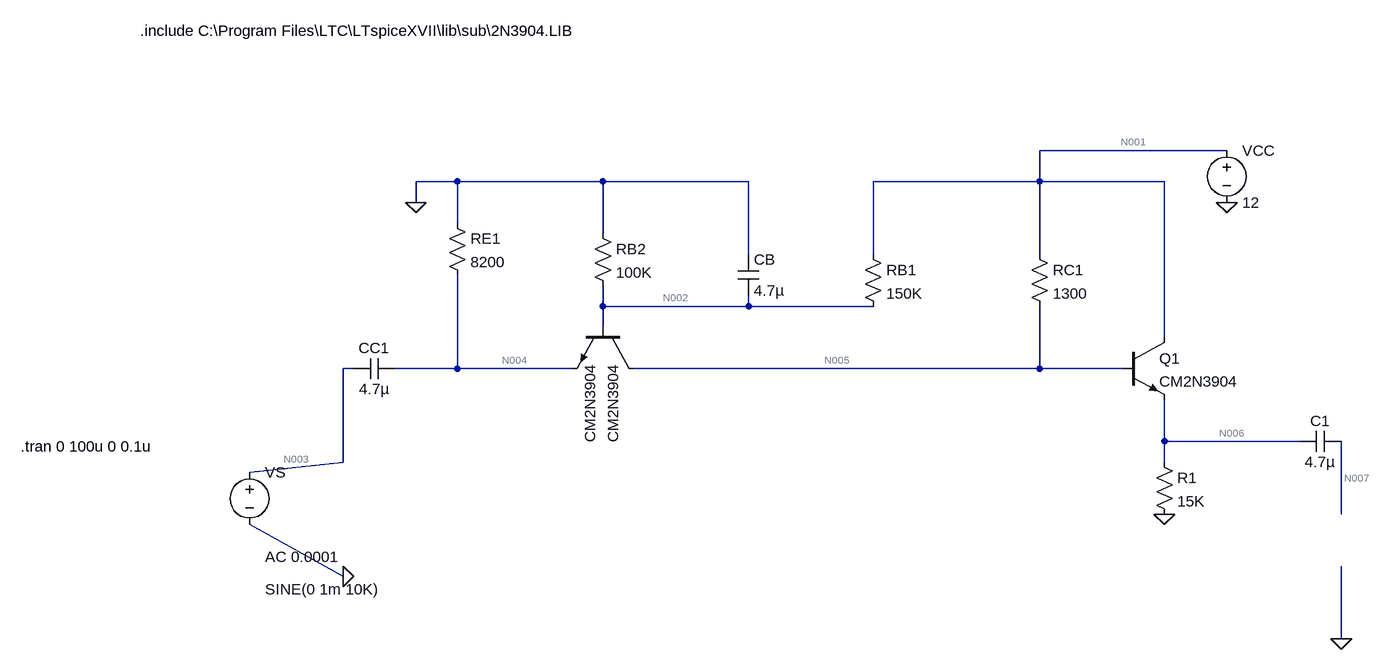
[diagram p0: schematic Part 2 circuit input resistance.asc]
Part 2 circuit input resistance.asc, the LTspice schematic file:
Version 4
SHEET 1 1872 996
WIRE 1616 208 1328 208
WIRE 432 256 368 256
WIRE 656 256 432 256
WIRE 880 256 656 256
WIRE 1328 256 1328 208
WIRE 1328 256 1072 256
WIRE 1520 256 1328 256
WIRE 368 288 368 256
WIRE 432 320 432 256
WIRE 656 336 656 256
WIRE 880 368 880 256
WIRE 1072 368 1072 256
WIRE 1328 368 1328 256
WIRE 656 448 656 416
WIRE 880 448 880 432
WIRE 880 448 656 448
WIRE 1072 448 880 448
WIRE 656 480 656 448
WIRE 1520 496 1520 256
WIRE 272 544 256 544
WIRE 432 544 432 400
WIRE 432 544 336 544
WIRE 608 544 432 544
WIRE 1328 544 1328 448
WIRE 1328 544 704 544
WIRE 1456 544 1328 544
WIRE 1520 656 1520 592
WIRE 1728 656 1520 656
WIRE 256 688 256 544
WIRE 1520 688 1520 656
WIRE 112 704 256 688
WIRE 1792 768 1792 656
WIRE 256 864 112 784
WIRE 1792 960 1792 848
FLAG 368 288 0
FLAG 1520 768 0
FLAG 1616 288 0
FLAG 1792 960 0
FLAG 256 864 0
SYMBOL cap 336 528 R90
WINDOW 0 0 32 VBottom 2
WINDOW 3 32 32 VTop 2
SYMATTR InstName CC1
SYMATTR Value 4.7µ
SYMBOL res 416 304 R0
SYMATTR InstName RE1
SYMATTR Value 8200
SYMBOL res 640 320 R0
SYMATTR InstName RB2
SYMATTR Value 100K
SYMBOL cap 864 368 R0
SYMATTR InstName CB
SYMATTR Value 4.7µ
SYMBOL npn 704 480 R90
SYMATTR InstName CM2N3904
SYMATTR Value CM2N3904
SYMBOL res 1056 352 R0
SYMATTR InstName RB1
SYMATTR Value 150K
SYMBOL res 1312 352 R0
SYMATTR InstName RC1
SYMATTR Value 1300
SYMBOL npn 1456 496 R0
SYMATTR InstName Q1
SYMATTR Value CM2N3904
SYMBOL res 1504 672 R0
SYMATTR InstName R1
SYMATTR Value 15K
SYMBOL cap 1792 640 R90
WINDOW 0 0 32 VBottom 2
WINDOW 3 32 32 VTop 2
SYMATTR InstName C1
SYMATTR Value 4.7µ
SYMBOL voltage 1616 192 R0
SYMATTR InstName VCC
SYMATTR Value 12
SYMBOL voltage 112 688 R0
WINDOW 3 24 196 Left 2
WINDOW 123 24 146 Left 2
WINDOW 39 0 0 Left 0
SYMATTR Value SINE(0 1m 10K)
SYMATTR Value2 AC 0.0001
SYMATTR InstName VS
TEXT -56 24 Left 2 !.include C:\\Program Files\\LTC\\LTspiceXVII\\lib\\sub\\2N3904.LIB
TEXT -240 664 Left 2 !.tran 0 100u 0 0.1u

The netlist it stands for:
* Part 2 circuit input resistance.asc
CC1 N004 N003 4.7µ
RE1 0 N004 8200
RB2 0 N002 100K
CB 0 N002 4.7µ
Q§CM2N3904 N005 N002 N004 0 CM2N3904
RB1 N001 N002 150K
RC1 N001 N005 1300
Q1 N001 N005 N006 0 CM2N3904
R1 N006 0 15K
C1 N007 N006 4.7µ
VCC N001 0 12
VS N003 0 SINE(0 1m 10K) AC 0.0001
.model NPN NPN
.model PNP PNP
.lib standard.bjt
.include C:\Program Files\LTC\LTspiceXVII\lib\sub\2N3904.LIB
.tran 0 100u 0 0.1u
.backanno
.end

* Results of the author's LTspice run, read from the files saved beside the schematic
* Operating Point, zero values left out:
*   V(n004) = 3.903 V
*   V(n002) = 4.529 V
*   V(n005) = 11.38 V
*   V(n001) = 12 V
*   V(n006) = 10.74 V
*   V(n007) = 50.48 µV
*   Ic(Q1) = 709.4 µA
*   Ib(Q1) = 6.584 µA
*   Ie(Q1) = -716 µA
*   Ic(Cm2n3904) = 471.4 µA
*   Ib(Cm2n3904) = 4.525 µA
*   Ie(Cm2n3904) = -476 µA
*   I(R1) = 716 µA
*   I(Rc1) = 478 µA
*   I(Rb1) = 49.81 µA
*   I(Rb2) = -45.29 µA
*   I(Re1) = -476 µA
*   I(Vcc) = -1.237 mA
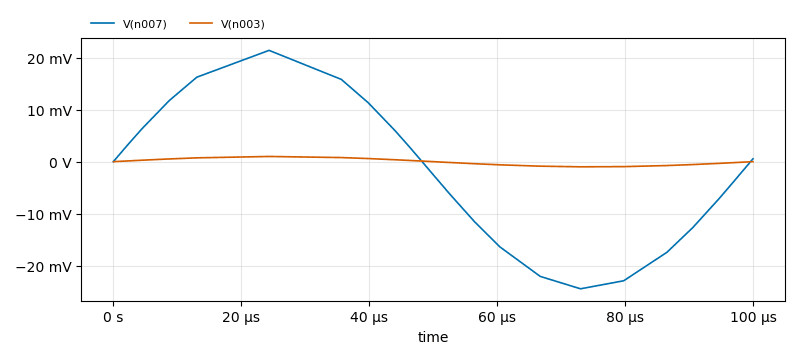
[diagram p1: Transient Analysis of Part 2 circuit input resistance.asc, plotted from the saved traces]
* Transient Analysis, 1 run:
*   V(n007): min -24.44 mV, max 21.39 mV, average -1.441 mV, rms 16 mV, last 553.8 µV
*   V(n003): min -992.4 µV, max 997.6 µV, average -5.81 µV, rms 695.4 µV, last 0 V